# Altium project MLX.PrjPcb
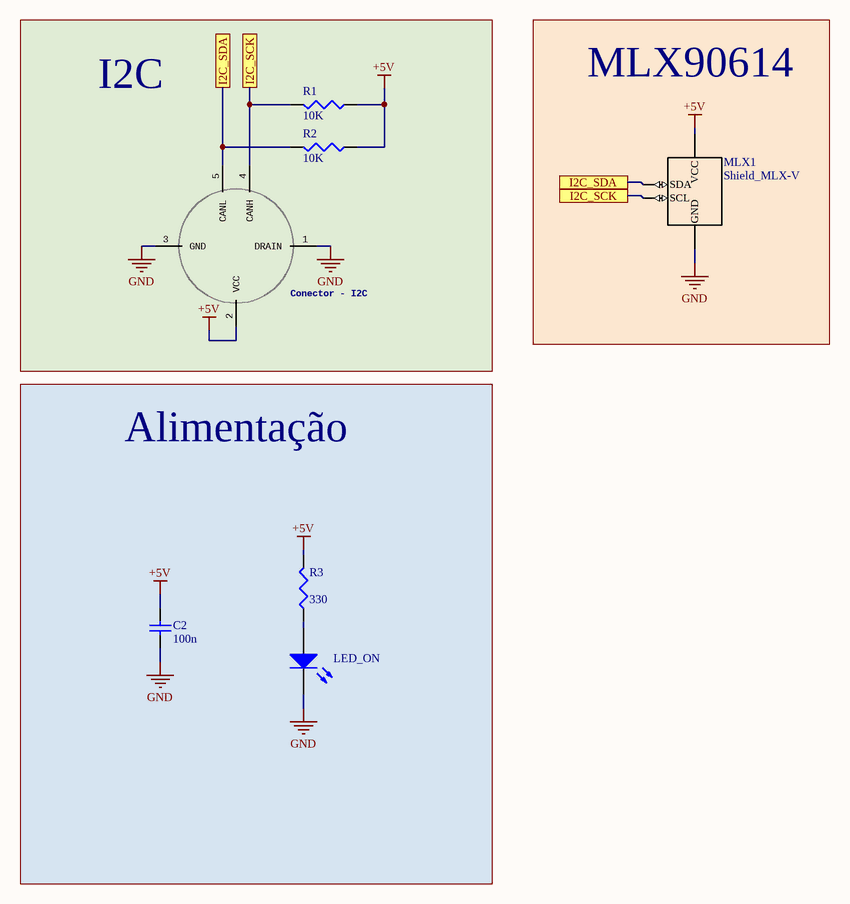
[diagram p0: Schematicmlx.SchDoc]
1 sheet, 7 parts. Net scope: flat (ports and power ports of the same name join across sheets).
Board file: PCB1.PcbDoc

## Sheet Schematicmlx.SchDoc
size A4

### Parts
C2  100n  [C1206]
Conector_-_I2C  (no value)  [RSWF-5]
LED_ON  LED3  [C1206]  (value not drawn)
MLX1  Shield_MLX-V  [Shield_MLX-V]
R1  value 10K  [C1206]  (hidden comment: Res3)
R2  value 10K  [C1206]  (hidden comment: Res3)
R3  330  [C1206]

### Blocks framed on the sheet
I2C: Conector_-_I2C R1 R2
MLX90614: MLX1
Alimentação: C2 LED_ON R3

### Ports
I2C_SCK, I2C_SDA

### Nets
+5V: C2.2 Conector_-_I2C.2(VCC) MLX1.VCC R1.1 R2.1 R3.2
GND: C2.1 Conector_-_I2C.1(DRAIN) Conector_-_I2C.3(GND) LED_ON.2(K) MLX1.GND
NetConector_-_I2C_4: Conector_-_I2C.4(CANH) MLX1.SCL R1.2 ; port I2C_SCK
NetConector_-_I2C_5: Conector_-_I2C.5(CANL) MLX1.SDA R2.2 ; port I2C_SDA
NetLED_ON_1: LED_ON.1(A) R3.1

### Library data of the parts
C2 = Cap Semi: Capacitor (Semiconductor SIM Model); Published: 8-Jun-2000; LatestRevisionDate: 29-May-2009; LatestRevisionNote: IPC-7351 Footprint Added.; PackageReference: C1206; Publisher: Altium Limited; PackageDescription: Chip Capacitor
Conector_-_I2C = RSWF-5: GateName_1: G$1; SymbolName_1: RSWF-5; LibraryName: RSWF-5; DeviceSetName: RSWF-5; Package: RSWF-5
LED_ON = LED3: Typical BLUE SiC LED; Published: 8-Jun-2000; LatestRevisionDate: 17-Dec-2003; LatestRevisionNote: PCB Footprint replaced.; DatasheetVersion: 16-Apr-2002; PackageVersion: 16-Apr-2002; PackageReference: 3.5X2.8X1.9; Publisher: Altium Limited; PackageDescription: SM LED; 2 C-Bend Leads; Body 3.5 x 2.8 x 1.9 mm, inc leads (LxWxH typ)
R1-R3 = Res3: Resistor; Published: 8-Jun-2000; LatestRevisionDate: 29-May-2009; LatestRevisionNote: IPC-7351 Footprint Added.; PackageReference: J1-0603; Publisher: Altium Limited; PackageDescription: Chip Resistor
  R3: Value: 330